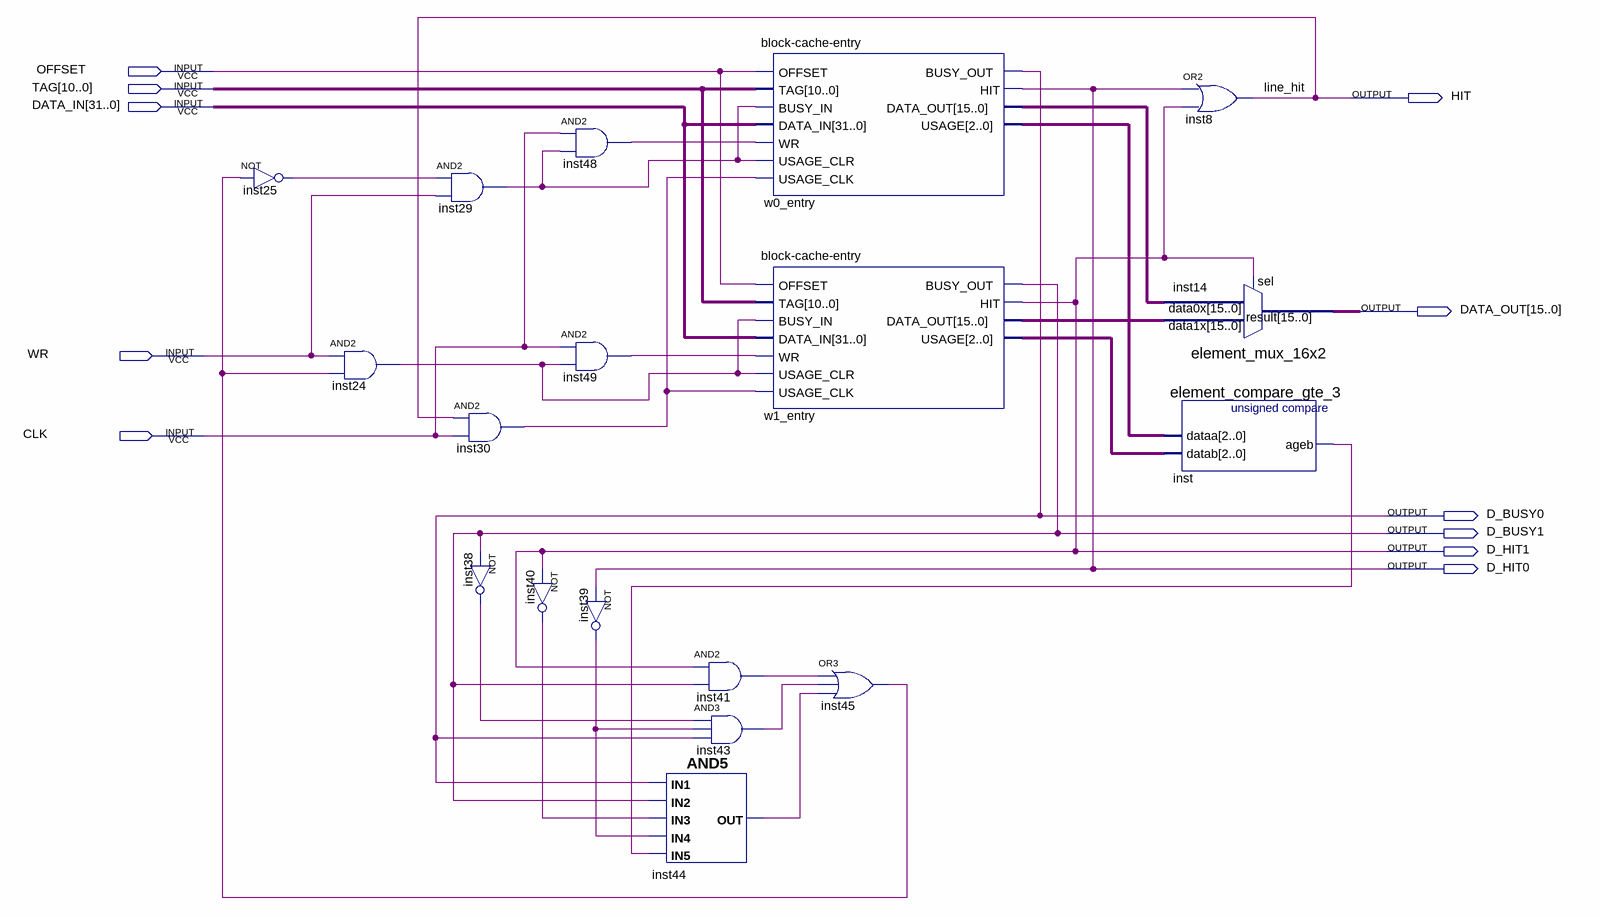
[diagram p0: schematic sheet]
// Quartus schematic block-data-cache-line.bdf as structural Verilog: 18 symbols, 11 pins
module \block-data-cache-line  (
  input  OFFSET,
  input  [10:0] TAG,
  input  [31:0] DATA_IN,
  input  WR,
  input  CLK,
  output HIT,
  output [15:0] DATA_OUT,
  output D_BUSY0,
  output D_BUSY1,
  output D_HIT1,
  output D_HIT0
);

  wire inst24_out, inst25_out, inst29_out, inst30_out, inst38_out, inst39_out, inst40_out, inst41_out,
       inst43_out, inst44_out, inst45_out, inst48_out, inst49_out, inst_ageb;
  wire [2:0] w0_entry_usage, w1_entry_usage;
  wire [15:0] w0_entry_data_out, w1_entry_data_out;

  not inst25 (inst25_out, inst45_out);
  and inst24 (inst24_out, WR, inst45_out);
  and inst29 (inst29_out, inst25_out, WR);
  and inst30 (inst30_out, HIT, CLK);
  not inst38 (inst38_out, D_BUSY1);
  not inst40 (inst40_out, D_HIT1);
  and inst48 (inst48_out, CLK, inst29_out);
  and inst49 (inst49_out, CLK, inst24_out);
  not inst39 (inst39_out, D_HIT0);
  and inst44 (inst44_out, D_BUSY0, D_BUSY1, inst40_out, inst39_out, inst_ageb);
  \block-cache-entry  w0_entry (
    .OFFSET(OFFSET), .TAG(TAG), .BUSY_IN(inst29_out), .DATA_IN(DATA_IN), .WR(inst48_out),
    .USAGE_CLR(inst29_out), .USAGE_CLK(inst30_out), .BUSY_OUT(D_BUSY0), .HIT(D_HIT0),
    .DATA_OUT(w0_entry_data_out), .USAGE(w0_entry_usage));
  \block-cache-entry  w1_entry (
    .OFFSET(OFFSET), .TAG(TAG), .BUSY_IN(inst24_out), .DATA_IN(DATA_IN), .WR(inst49_out),
    .USAGE_CLR(inst24_out), .USAGE_CLK(inst30_out), .BUSY_OUT(D_BUSY1), .HIT(D_HIT1),
    .DATA_OUT(w1_entry_data_out), .USAGE(w1_entry_usage));
  and inst41 (inst41_out, D_HIT1, D_BUSY1);
  and inst43 (inst43_out, inst38_out, inst39_out, D_BUSY0);
  or inst45 (inst45_out, inst41_out, inst43_out, inst44_out);
  or inst8 (HIT, D_HIT0, D_HIT1);
  element_mux_16x2 inst14 (.data1x(w1_entry_data_out), .data0x(w0_entry_data_out), .sel(D_HIT1), .result(DATA_OUT));
  element_compare_gte_3 inst (.dataa(w0_entry_usage), .datab(w1_entry_usage), .ageb(inst_ageb));

  // Other names for the same wires on the sheet: line_hit = HIT
endmodule
